# Altium schematic sheet TM4C-Interfaces.SchDoc
size A3; DocumentNumber: 7-; SheetNumber: 7; SheetTotal: 7
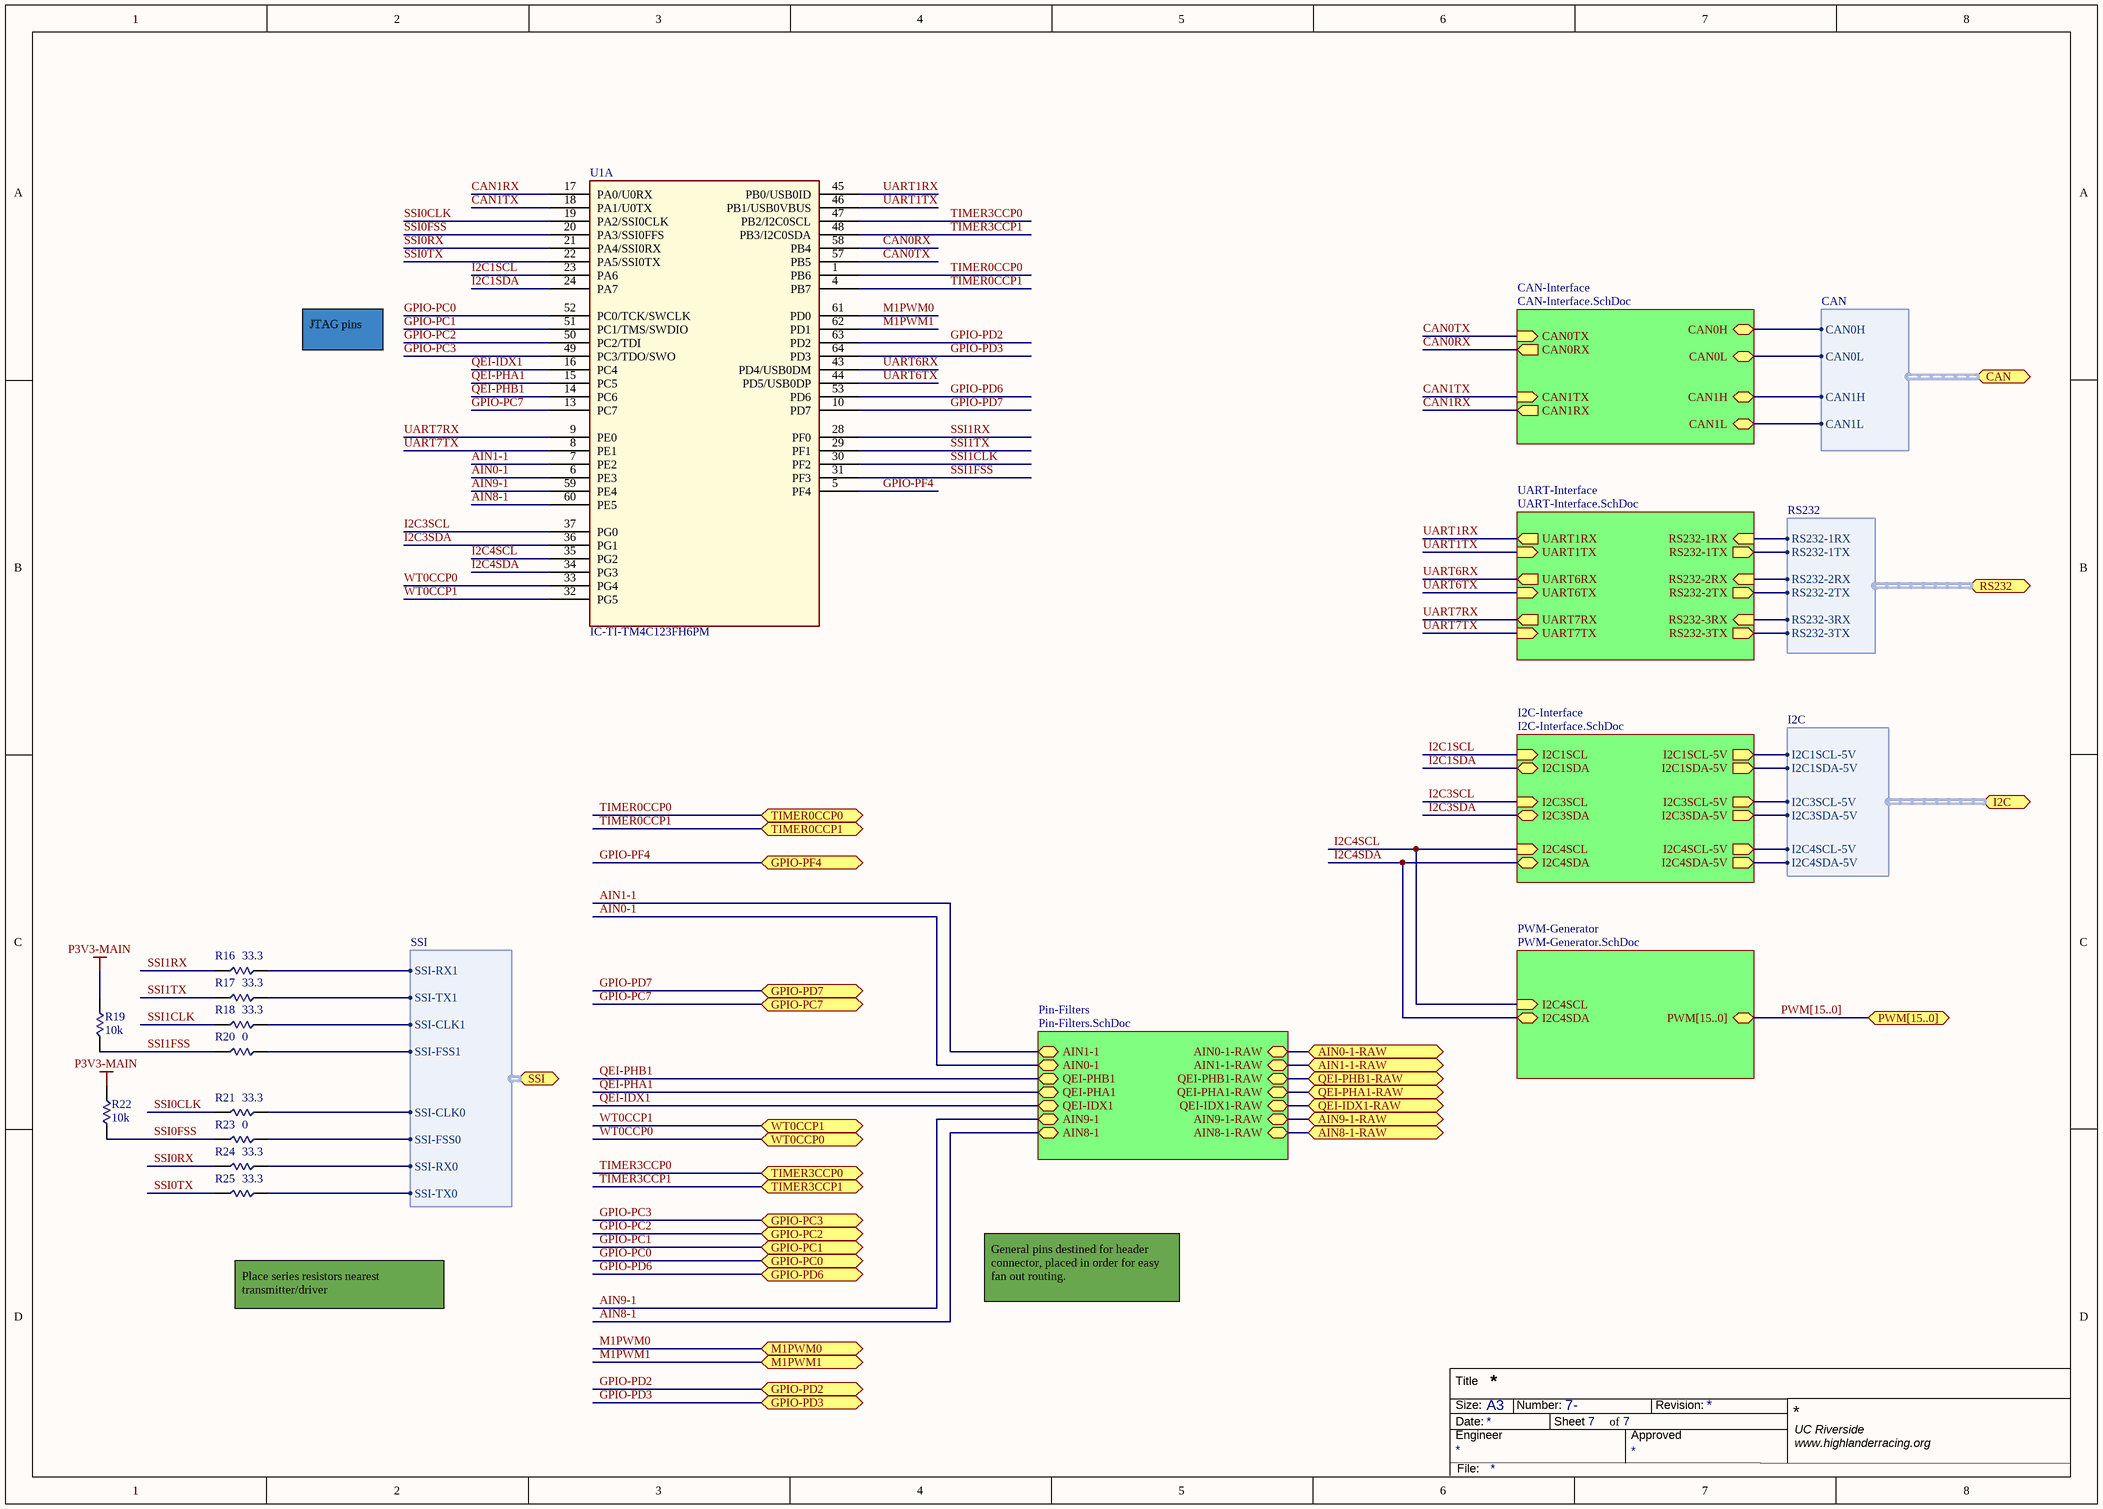
[diagram p0: TM4C-Interfaces.SchDoc]

## Parts
R16  value 33.3  [FOOTPRINT-0805-GEN]  (hidden comment: SMC)
R17  value 33.3  [FOOTPRINT-0805-GEN]  (hidden comment: SMC)
R18  value 33.3  [FOOTPRINT-0805-GEN]  (hidden comment: SMC)
R19  value 10k  [FOOTPRINT-0805-GEN]  (hidden comment: SMC)
R20  value 0  [FOOTPRINT-0805-GEN]  (hidden comment: SMC)
R21  value 33.3  [FOOTPRINT-0805-GEN]  (hidden comment: SMC)
R22  value 10k  [FOOTPRINT-0805-GEN]  (hidden comment: SMC)
R23  value 0  [FOOTPRINT-0805-GEN]  (hidden comment: SMC)
R24  value 33.3  [FOOTPRINT-0805-GEN]  (hidden comment: SMC)
R25  value 33.3  [FOOTPRINT-0805-GEN]  (hidden comment: SMC)
U1  IC-TI-TM4C123FH6PM  [FOOTPRINT-TI-TM4C123-64-LQFP]  (part A of 2)

## Sub-sheets
CAN-Interface = CAN-Interface.SchDoc: CAN0TX (in), CAN0RX (out), CAN1TX (in), CAN1RX (out), CAN0H (bidir), CAN0L (bidir), CAN1H (bidir), CAN1L (bidir)
I2C-Interface = I2C-Interface.SchDoc: I2C1SCL (in), I2C1SDA (bidir), I2C3SCL (in), I2C3SDA (bidir), I2C4SCL (in), I2C4SDA (bidir), I2C1SCL-5V (out), I2C1SDA-5V (out), I2C3SDA-5V (out), I2C3SCL-5V (out), I2C4SCL-5V (out), I2C4SDA-5V (out)
Pin-Filters = Pin-Filters.SchDoc: AIN1-1 (bidir), AIN8-1 (bidir), QEI-PHB1 (bidir), QEI-PHA1 (bidir), AIN0-1 (bidir), QEI-IDX1 (bidir), AIN9-1 (bidir), AIN8-1-RAW (bidir), AIN9-1-RAW (bidir), QEI-IDX1-RAW (bidir), QEI-PHA1-RAW (bidir), QEI-PHB1-RAW (bidir), AIN1-1-RAW (bidir), AIN0-1-RAW (bidir)
PWM-Generator = PWM-Generator.SchDoc: I2C4SCL (in), I2C4SDA (bidir), PWM[15..0] (bidir)
UART-Interface = UART-Interface.SchDoc: UART1RX (out), UART1TX (in), UART6RX (out), UART6TX (in), UART7RX (out), UART7TX (in), RS232-1RX (in), RS232-1TX (out), RS232-2RX (in), RS232-2TX (out), RS232-3RX (in), RS232-3TX (out)

## Ports
AIN0-1-RAW (bidir), AIN1-1-RAW (bidir), AIN8-1-RAW (bidir), AIN9-1-RAW (bidir), CAN (bidir, harness CAN), GPIO-PC0 (bidir), GPIO-PC1 (bidir), GPIO-PC2 (bidir), GPIO-PC3 (bidir), GPIO-PC7 (bidir), GPIO-PD2 (bidir), GPIO-PD3 (bidir), GPIO-PD6 (bidir), GPIO-PD7 (bidir), GPIO-PF4 (bidir), I2C (bidir, harness I2C), M1PWM0 (bidir), M1PWM1 (bidir), PWM[15..0] (bidir), QEI-IDX1-RAW (bidir), QEI-PHA1-RAW (bidir), QEI-PHB1-RAW (bidir), RS232 (bidir, harness RS232), SSI (bidir, harness SSI), TIMER0CCP0 (bidir), TIMER0CCP1 (bidir), TIMER3CCP0 (bidir), TIMER3CCP1 (bidir), WT0CCP0 (bidir), WT0CCP1 (bidir)

## Harnesses
SSI: SSI-TX1, SSI-CLK1, SSI-RX1, SSI-FSS1, SSI-CLK0, SSI-FSS0, SSI-RX0, SSI-TX0
RS232: RS232-1RX, RS232-1TX, RS232-2RX, RS232-2TX, RS232-3RX, RS232-3TX
I2C: I2C1SCL-5V, I2C1SDA-5V, I2C3SCL-5V, I2C3SDA-5V, I2C4SCL-5V, I2C4SDA-5V
CAN: CAN0H, CAN0L, CAN1H, CAN1L

## Nets
P3V3-MAIN: R19.2 R22.2
AIN0-1: U1.6(PE3) ; sheet Pin-Filters/AIN0-1
AIN0-1-RAW: port AIN0-1-RAW, sheet Pin-Filters/AIN0-1-RAW
AIN1-1: U1.7(PE2) ; sheet Pin-Filters/AIN1-1
AIN1-1-RAW: port AIN1-1-RAW, sheet Pin-Filters/AIN1-1-RAW
AIN8-1: U1.60(PE5) ; sheet Pin-Filters/AIN8-1
AIN8-1-RAW: port AIN8-1-RAW, sheet Pin-Filters/AIN8-1-RAW
AIN9-1: U1.59(PE4) ; sheet Pin-Filters/AIN9-1
AIN9-1-RAW: port AIN9-1-RAW, sheet Pin-Filters/AIN9-1-RAW
CAN0RX: U1.58(PB4) ; sheet CAN-Interface/CAN0RX
CAN0TX: U1.57(PB5) ; sheet CAN-Interface/CAN0TX
CAN1RX: U1.17(PA0/U0RX) ; sheet CAN-Interface/CAN1RX
CAN1TX: U1.18(PA1/U0TX) ; sheet CAN-Interface/CAN1TX
GPIO-PC0: U1.52(PC0/TCK/SWCLK) ; port GPIO-PC0
GPIO-PC1: U1.51(PC1/TMS/SWDIO) ; port GPIO-PC1
GPIO-PC2: U1.50(PC2/TDI) ; port GPIO-PC2
GPIO-PC3: U1.49(PC3/TDO/SWO) ; port GPIO-PC3
GPIO-PC7: U1.13(PC7) ; port GPIO-PC7
GPIO-PD2: U1.63(PD2) ; port GPIO-PD2
GPIO-PD3: U1.64(PD3) ; port GPIO-PD3
GPIO-PD6: U1.53(PD6) ; port GPIO-PD6
GPIO-PD7: U1.10(PD7) ; port GPIO-PD7
GPIO-PF4: U1.5(PF4) ; port GPIO-PF4
I2C1SCL: U1.23(PA6) ; sheet I2C-Interface/I2C1SCL
I2C1SDA: U1.24(PA7) ; sheet I2C-Interface/I2C1SDA
I2C3SCL: U1.37(PG0) ; sheet I2C-Interface/I2C3SCL
I2C3SDA: U1.36(PG1) ; sheet I2C-Interface/I2C3SDA
I2C4SCL: U1.35(PG2) ; sheet I2C-Interface/I2C4SCL, sheet PWM-Generator/I2C4SCL
I2C4SDA: U1.34(PG3) ; sheet I2C-Interface/I2C4SDA, sheet PWM-Generator/I2C4SDA
M1PWM0: U1.61(PD0) ; port M1PWM0
M1PWM1: U1.62(PD1) ; port M1PWM1
QEI-IDX1: U1.16(PC4) ; sheet Pin-Filters/QEI-IDX1
QEI-IDX1-RAW: port QEI-IDX1-RAW, sheet Pin-Filters/QEI-IDX1-RAW
QEI-PHA1: U1.15(PC5) ; sheet Pin-Filters/QEI-PHA1
QEI-PHA1-RAW: port QEI-PHA1-RAW, sheet Pin-Filters/QEI-PHA1-RAW
QEI-PHB1: U1.14(PC6) ; sheet Pin-Filters/QEI-PHB1
QEI-PHB1-RAW: port QEI-PHB1-RAW, sheet Pin-Filters/QEI-PHB1-RAW
SSI0CLK: R21.1 U1.19(PA2/SSI0CLK)
SSI0FSS: R22.1 R23.1 U1.20(PA3/SSI0FFS)
SSI0RX: R24.1 U1.21(PA4/SSI0RX)
SSI0TX: R25.1 U1.22(PA5/SSI0TX)
SSI1CLK: R18.1 U1.30(PF2)
SSI1FSS: R19.1 R20.1 U1.31(PF3)
SSI1RX: R16.1 U1.28(PF0)
SSI1TX: R17.1 U1.29(PF1)
TIMER0CCP0: U1.1(PB6) ; port TIMER0CCP0
TIMER0CCP1: U1.4(PB7) ; port TIMER0CCP1
TIMER3CCP0: U1.47(PB2/I2C0SCL) ; port TIMER3CCP0
TIMER3CCP1: U1.48(PB3/I2C0SDA) ; port TIMER3CCP1
UART1RX: U1.45(PB0/USB0ID) ; sheet UART-Interface/UART1RX
UART1TX: U1.46(PB1/USB0VBUS) ; sheet UART-Interface/UART1TX
UART6RX: U1.43(PD4/USB0DM) ; sheet UART-Interface/UART6RX
UART6TX: U1.44(PD5/USB0DP) ; sheet UART-Interface/UART6TX
UART7RX: U1.9(PE0) ; sheet UART-Interface/UART7RX
UART7TX: U1.8(PE1) ; sheet UART-Interface/UART7TX
WT0CCP0: U1.33(PG4) ; port WT0CCP0
WT0CCP1: U1.32(PG5) ; port WT0CCP1
NetR16_2: R16.2 ; port SSI.SSI-RX1
NetR17_2: R17.2 ; port SSI.SSI-TX1
NetR18_2: R18.2 ; port SSI.SSI-CLK1
NetR20_2: R20.2 ; port SSI.SSI-FSS1
NetR21_2: R21.2 ; port SSI.SSI-CLK0
NetR23_2: R23.2 ; port SSI.SSI-FSS0
NetR24_2: R24.2 ; port SSI.SSI-RX0
NetR25_2: R25.2 ; port SSI.SSI-TX0
(unnamed): sheet CAN-Interface/CAN0H, port CAN.CAN0H
(unnamed): sheet CAN-Interface/CAN0L, port CAN.CAN0L
(unnamed): sheet CAN-Interface/CAN1H, port CAN.CAN1H
(unnamed): sheet CAN-Interface/CAN1L, port CAN.CAN1L
(unnamed): sheet UART-Interface/RS232-1RX, port RS232.RS232-1RX
(unnamed): sheet UART-Interface/RS232-1TX, port RS232.RS232-1TX
(unnamed): sheet UART-Interface/RS232-2RX, port RS232.RS232-2RX
(unnamed): sheet UART-Interface/RS232-2TX, port RS232.RS232-2TX
(unnamed): sheet UART-Interface/RS232-3RX, port RS232.RS232-3RX
(unnamed): sheet UART-Interface/RS232-3TX, port RS232.RS232-3TX
(unnamed): sheet I2C-Interface/I2C1SCL-5V, port I2C.I2C1SCL-5V
(unnamed): sheet I2C-Interface/I2C1SDA-5V, port I2C.I2C1SDA-5V
(unnamed): sheet I2C-Interface/I2C3SDA-5V, port I2C.I2C3SDA-5V
(unnamed): sheet I2C-Interface/I2C3SCL-5V, port I2C.I2C3SCL-5V
(unnamed): sheet I2C-Interface/I2C4SCL-5V, port I2C.I2C4SCL-5V
(unnamed): sheet I2C-Interface/I2C4SDA-5V, port I2C.I2C4SDA-5V

## Buses and harness runs
bus PWM[15..0] = port PWM[15..0] = sheet PWM-Generator/PWM[15..0]

## Notes on the sheet
- JTAG pins
- Place series resistors nearest transmitter/driver
- General pins destined for header connector, placed in order for easy fan out routing.
  Place filter circuit elements next to fanout >10mm from header.
- Title
- Size:
- Date:
- Engineer
- A3
- Number:
- Sheet
- of
- Approved
- Revision:
- UC Riverside
- www.highlanderracing.org <http://www.highlanderracing.org>
- File:

## Library data of the parts
R16-R25 = Resistor-Generic-0805-2012: 1/8 Watt Surface Mount Resistor